# EAGLE design moister-proto (EAGLE 7.7.0)

## Sheet 1 of 4
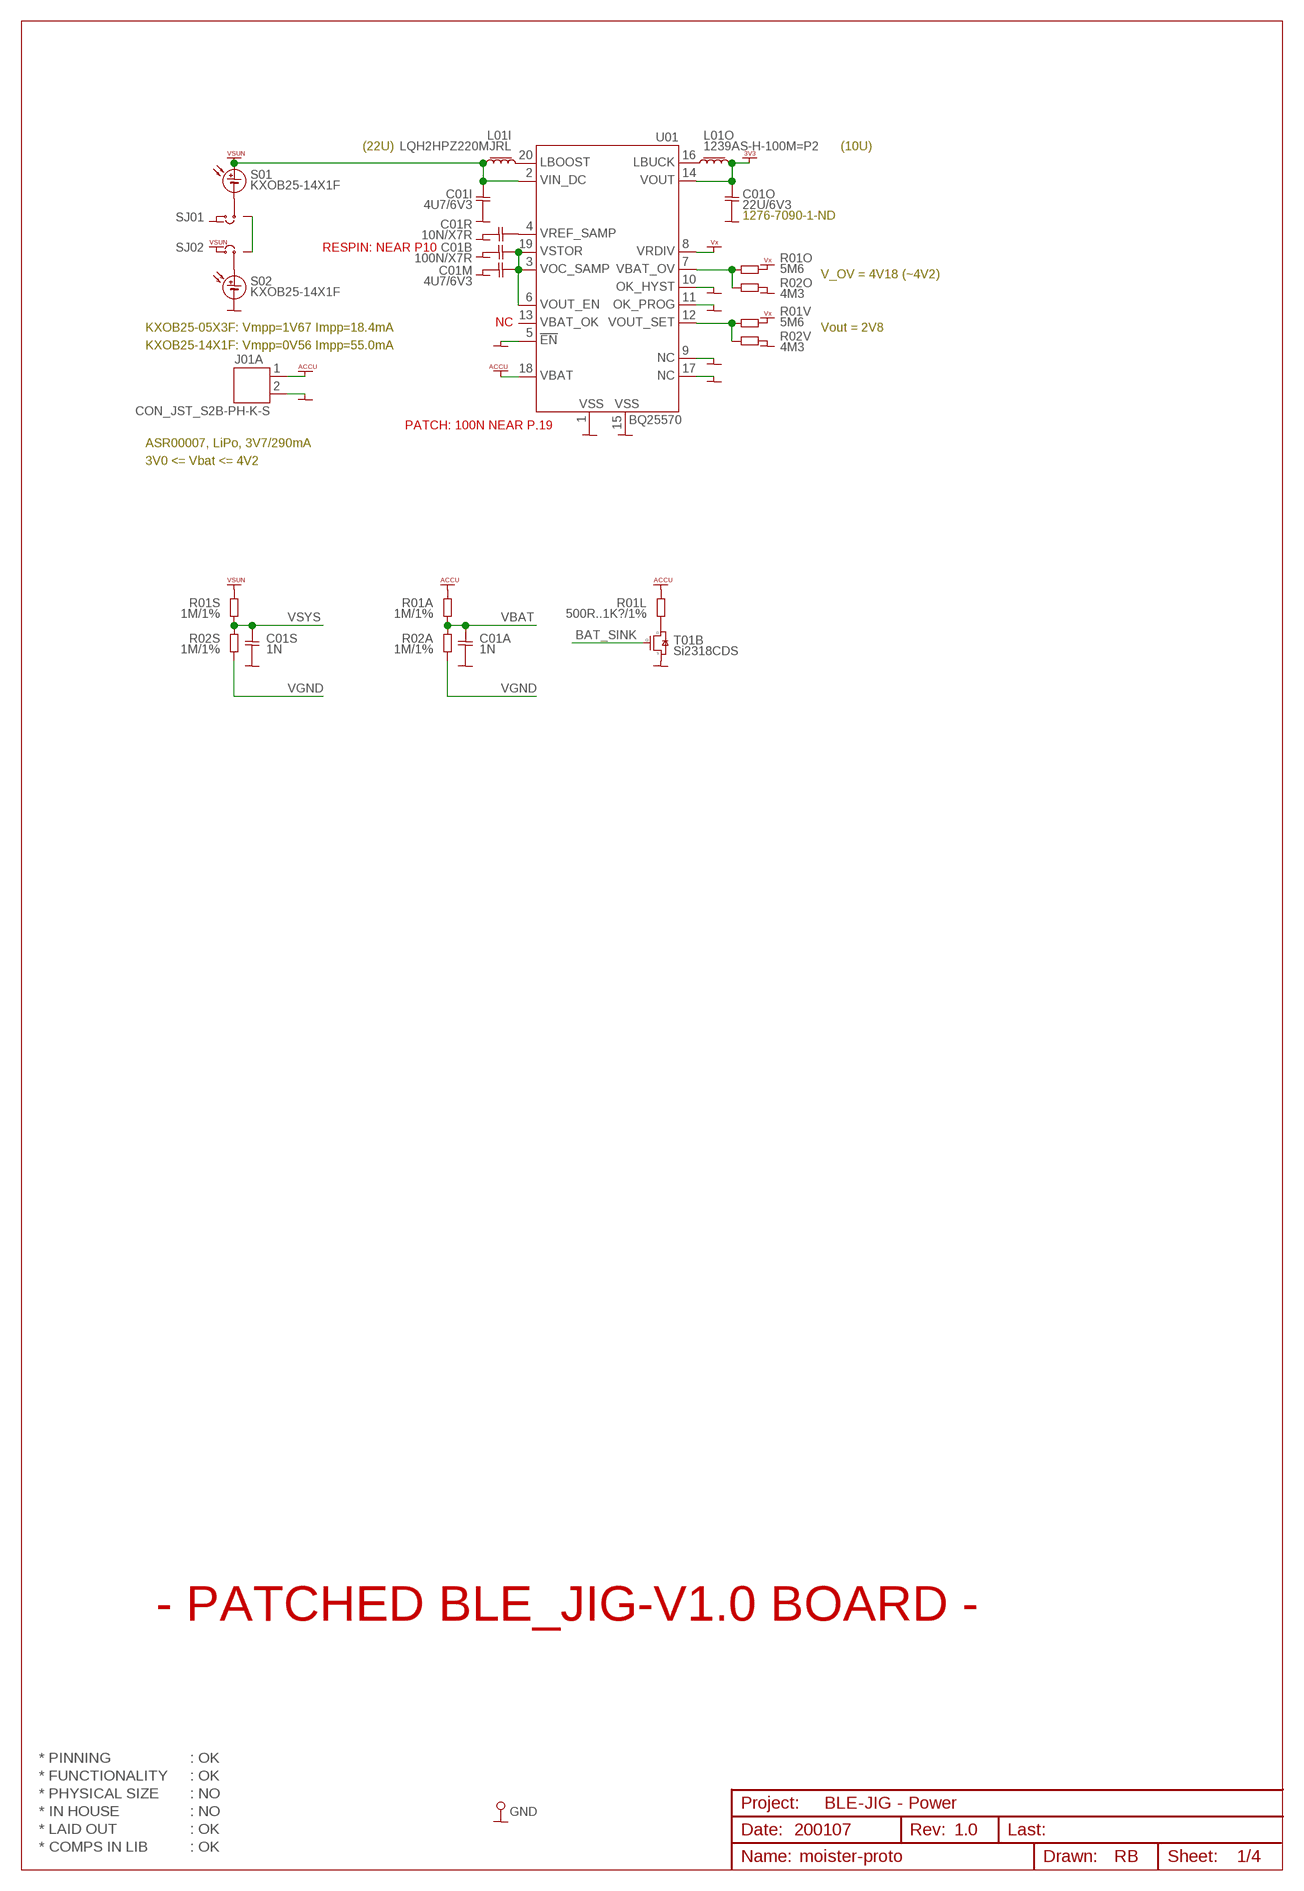
[diagram p0: schematic, sheet 1]

### Parts
C01A  1N  CAP0402  [CAP0402]
C01B  100N/X7R  CAP0402  [CAP0402]
C01I  4U7/6V3  CAP0402  [CAP0402]
C01M  4U7/6V3  CAP0402  [CAP0402]
C01O  22U/6V3  CAP0402  [CAP0402]
C01R  10N/X7R  CAP0402  [CAP0402]
C01S  1N  CAP0402  [CAP0402]
GND  PIN_TEST  [HOLE_PTH_0.8MM]
J01A  CON_JST_S2B-PH-K-S  [CON_JST_S2B-PH-K-S]
L01I  LQH2HPZ220MJRL  L_1008  [L_1008]
L01O  1239AS-H-100M=P2  L_1008  [L_1008]
R01A  1M/1%  RES0402  [RES0402]
R01L  500R..1K?/1%  RES0603  [RES0603]
R01O  5M6  RES0402  [RES0402]
R01S  1M/1%  RES0402  [RES0402]
R01V  5M6  RES0402  [RES0402]
R02A  1M/1%  RES0402  [RES0402]
R02O  4M3  RES0402  [RES0402]
R02S  1M/1%  RES0402  [RES0402]
R02V  4M3  RES0402  [RES0402]
S01  KXOB25-14X1F  [KXOB25-14X1F]
S02  KXOB25-14X1F  [KXOB25-14X1F]
SJ01  SJ3SJ3-S  [SJ3-S]
SJ02  SJ3SJ3-S  [SJ3-S]
T01B  Si2318CDS  NFET_SOT23  [NFET_SOT23]
U01  BQ25570  [VQFN20]

### Nets
ACCU: J01A.1 R01A.2 R01L.2 U01.18(18.VBAT) ; supply symbol labelled VACCU
BAT_SINK: T01B.1(G1) ; also sheet 2
GND: C01A.2 C01B.2 C01I.2 C01M.2 C01O.2 C01R.2 C01S.2 GND.1 J01A.2 R02O.2 R02V.2 S02.2 SJ01.1 T01B.2(S2) U01.1(1.VSS) U01.5(5.!EN) U01.9(9.NC) U01.10(10.OK_HYST) U01.11(11.OK_PROG) U01.15(15.VSS) U01.17(17.NC) U01.TP(15.VSS) U01.V1(15.VSS) U01.V2(15.VSS) U01.V3(15.VSS) U01.V4(15.VSS) ; also sheet 2,3,4
N$1: S01.2 SJ01.2
N$4: S02.1 SJ02.2
N$6: SJ01.3 SJ02.3
N$8: R01L.1 T01B.3(D3)
N$11: C01R.1 U01.4(4.VREF_SAMP)
N$16: L01I.2 U01.20(20.LBOOST)
N$17: L01O.1 U01.16(16.LBUCK)
VBAT: C01A.1 R01A.1 R02A.2 ; also sheet 2
VBAT_OV: R01O.2 R02O.1 U01.7(7.VBAT_OV)
VDD_3V3: C01O.1 L01O.2 U01.14(14.VOUT) ; supply symbol labelled VCC_3V3 ; also sheet 2,3,4
VGND: R02A.1 R02S.1 ; also sheet 2
VOUT_SET: R01V.2 R02V.1 U01.12(12.VOUT_SET)
VSTOR: C01B.1 C01M.1 U01.3(3.VOC_SAMP) U01.6(6.VOUT_EN) U01.19(19.VSTOR)
VSUN: C01I.1 L01I.1 R01S.2 S01.1 SJ02.1 U01.2(2.VIN_DC)
VSYS: C01S.1 R01S.1 R02S.2 ; also sheet 2
VX: R01O.1 R01V.1 U01.8(8.VRDIV)
Unconnected: U01.13(13.VBAT_OK)

### Notes on the sheet
- (22U) | (10U)
- 1276-7090-1-ND
- RESPIN: NEAR P10
- V_OV = 4V18 (~4V2)
- NC
- KXOB25-05X3F: Vmpp=1V67 Impp=18.4mA | Vout = 2V8
- KXOB25-14X1F: Vmpp=0V56 Impp=55.0mA
- PATCH: 100N NEAR P.19
- ASR00007, LiPo, 3V7/290mA
- 3V0 <= Vbat <= 4V2
- - PATCHED BLE_JIG-V1.0 BOARD -
- * PINNING | : OK
- * FUNCTIONALITY | : OK
- * PHYSICAL SIZE | : NO
- BLE-JIG - Power
- * IN HOUSE | : NO
- * LAID OUT | : OK | 200107 | 1.0
- * COMPS IN LIB | : OK

## Sheet 2 of 4
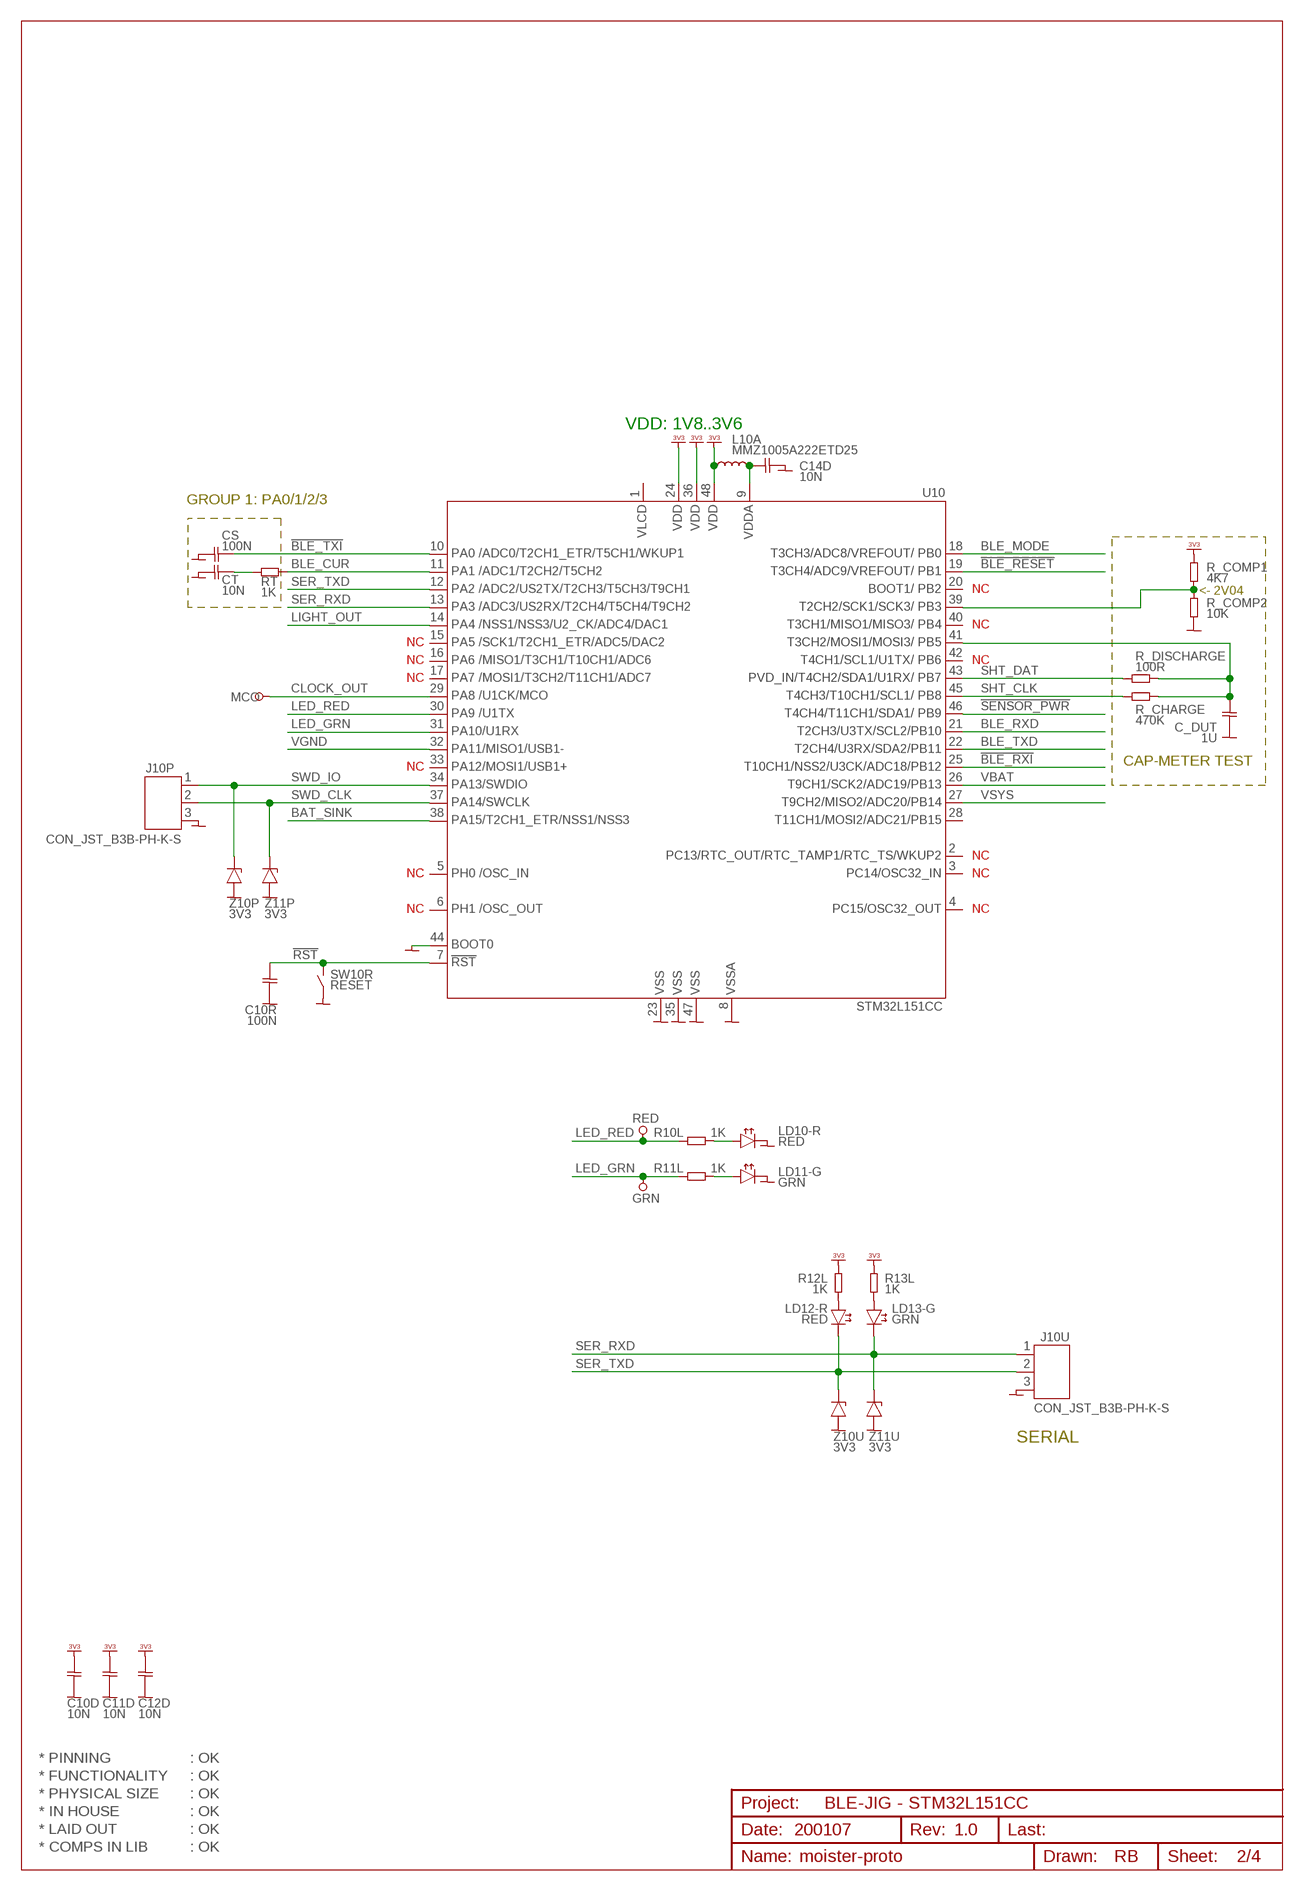
[diagram p1: schematic, sheet 2]

### Parts
C10D  10N  CAP0402  [CAP0402]
C10R  100N  CAP0402  [CAP0402]
C11D  10N  CAP0402  [CAP0402]
C12D  10N  CAP0402  [CAP0402]
C14D  10N  CAP0402  [CAP0402]
C_DUT  1U  CAP0603  [CAP0603]
CS  100N  CAP0805  [CAP0805]
CT  10N  CAP0805  [CAP0805]
GRN  PIN_TEST_0.6MM  [HOLE_PTH_0.6MM]
J10P  CON_JST_B3B-PH-K-S  [CON_JST_B3B-PH-K-S]
J10U  CON_JST_B3B-PH-K-S  [CON_JST_B3B-PH-K-S]
L10A  MMZ1005A222ETD25  L_0402  [L_0402]
LD10-R  RED  LED_SMD_0603  [LED_SMD_0603]
LD11-G  GRN  LED_SMD_0603  [LED_SMD_0603]
LD12-R  RED  LED_SMD_0603  [LED_SMD_0603]
LD13-G  GRN  LED_SMD_0603  [LED_SMD_0603]
MCO  PIN_TEST  [HOLE_PTH_0.8MM]
R10L  1K  RES0402  [RES0402]
R11L  1K  RES0402  [RES0402]
R12L  1K  RES0402  [RES0402]
R13L  1K  RES0402  [RES0402]
R_CHARGE  470K  RES0603  [RES0603]
R_COMP1  4K7  RES0603  [RES0603]
R_COMP2  10K  RES0603  [RES0603]
R_DISCHARGE  100R  RES0603  [RES0603]
RED  PIN_TEST_0.6MM  [HOLE_PTH_0.6MM]
RT  1K  RES0805  [RES0805]
SW10R  RESET  SWITCH_PUSHBUTTON_EVP-AVAA1A  [SWITCH_PUSHBUTTON_EVP-AVAA1A]
U10  STM32L151CC  [LQFP48]
Z10P  3V3  ZENER_SOD80  [ZENER_SOD80]
Z10U  3V3  ZENER_SOD80  [ZENER_SOD80]
Z11P  3V3  ZENER_SOD80  [ZENER_SOD80]
Z11U  3V3  ZENER_SOD80  [ZENER_SOD80]

### Nets
!BLE_RESET: U10.19(19.PB1) ; also sheet 3
!BLE_RXI: U10.25(25.PB12) ; also sheet 3
!BLE_TXI: CS.2 U10.10(10.PA0) ; also sheet 3
!RST: C10R.1 SW10R.1(1-2) U10.7(7.!RST)
!SENSOR_PWR: U10.46(46.PB9) ; also sheet 4
BAT_SINK: U10.38(38.PA15) ; also sheet 1
BLE_CUR: RT.1 U10.11(11.PA1) ; also sheet 3
BLE_MODE: U10.18(18.PB0) ; also sheet 3
BLE_RXD: U10.21(21.PB10) ; also sheet 3
BLE_TXD: U10.22(22.PB11) ; also sheet 3
CLOCK_OUT: MCO.1 U10.29(29.PA8)
COMP+: C_DUT.1 R_CHARGE.2 R_DISCHARGE.2 U10.41(41.PB5)
COMP-: R_COMP1.2 R_COMP2.1 U10.39(39.PB3)
GND: C10D.2 C10R.2 C11D.2 C12D.2 C14D.2 C_DUT.2 CS.1 CT.1 J10P.3 J10U.3 LD10-R.C LD11-G.C R_COMP2.2 SW10R.2(3-4) U10.8(8.GND) U10.23(23.GND) U10.35(35.GND) U10.44(44.BOOT0) U10.47(47.GND) Z10P.1(A) Z10U.1(A) Z11P.1(A) Z11U.1(A) ; also sheet 1,3,4
LED_GRN: GRN.1 R11L.1 U10.31(31.PA10)
LED_RED: R10L.1 RED.1 U10.30(30.PA9)
LIGHT_OUT: U10.14(14.PA4) ; also sheet 4
N$2: CT.2 RT.2
N$5: LD13-G.A R13L.2
N$7: LD12-R.A R12L.2
N$38: LD11-G.A R11L.2
N$39: LD10-R.A R10L.2
SER_RXD: J10U.1 LD13-G.C U10.13(13.PA3) Z11U.2(C)
SER_TXD: J10U.2 LD12-R.C U10.12(12.PA2) Z10U.2(C)
SHT_CLK: R_CHARGE.1 U10.45(45.PB8) ; also sheet 4
SHT_DAT: R_DISCHARGE.1 U10.43(43.PB7) ; also sheet 4
SWD_CLK: J10P.2 U10.37(37.PA14) Z11P.2(C)
SWD_IO: J10P.1 U10.34(34.PA13) Z10P.2(C)
VBAT: U10.26(26.PB13) ; also sheet 1
VDD_3V3: C10D.1 C11D.1 C12D.1 L10A.1 R12L.1 R13L.1 R_COMP1.1 U10.24(24.VDD) U10.36(36.VDD) U10.48(48.VDD) ; supply symbol labelled VCC_3V3 ; also sheet 1,3,4
VDDA: C14D.1 L10A.2 U10.9(9.VDD)
VGND: U10.32(32.PA11) ; also sheet 1
VSYS: U10.27(27.PB14) ; also sheet 1
Unconnected: U10.1(1.VDD) U10.2(2.PC13) U10.3(3.PC14) U10.4(4.PC15) U10.5(5.OSC_IN) U10.6(6.OSC_OUT) U10.15(15.PA5) U10.16(16.PA6) U10.17(17.PA7) U10.20(20.PB2) U10.28(28.PB15) U10.33(33.PA12) U10.40(40.PB4) U10.42(42.PB6)

### Notes on the sheet
- VDD: 1V8..3V6
- GROUP 1: PA0/1/2/3
- NC | <- 2V04
- NC
- NC
- NC | NC
- NC
- CAP-METER TEST
- NC
- NC
- NC | NC
- NC | NC
- SERIAL
- * PINNING | : OK
- * FUNCTIONALITY | : OK
- * PHYSICAL SIZE | : OK
- BLE-JIG - STM32L151CC
- * IN HOUSE | : OK
- * LAID OUT | : OK | 200107 | 1.0
- * COMPS IN LIB | : OK

## Sheet 3 of 4
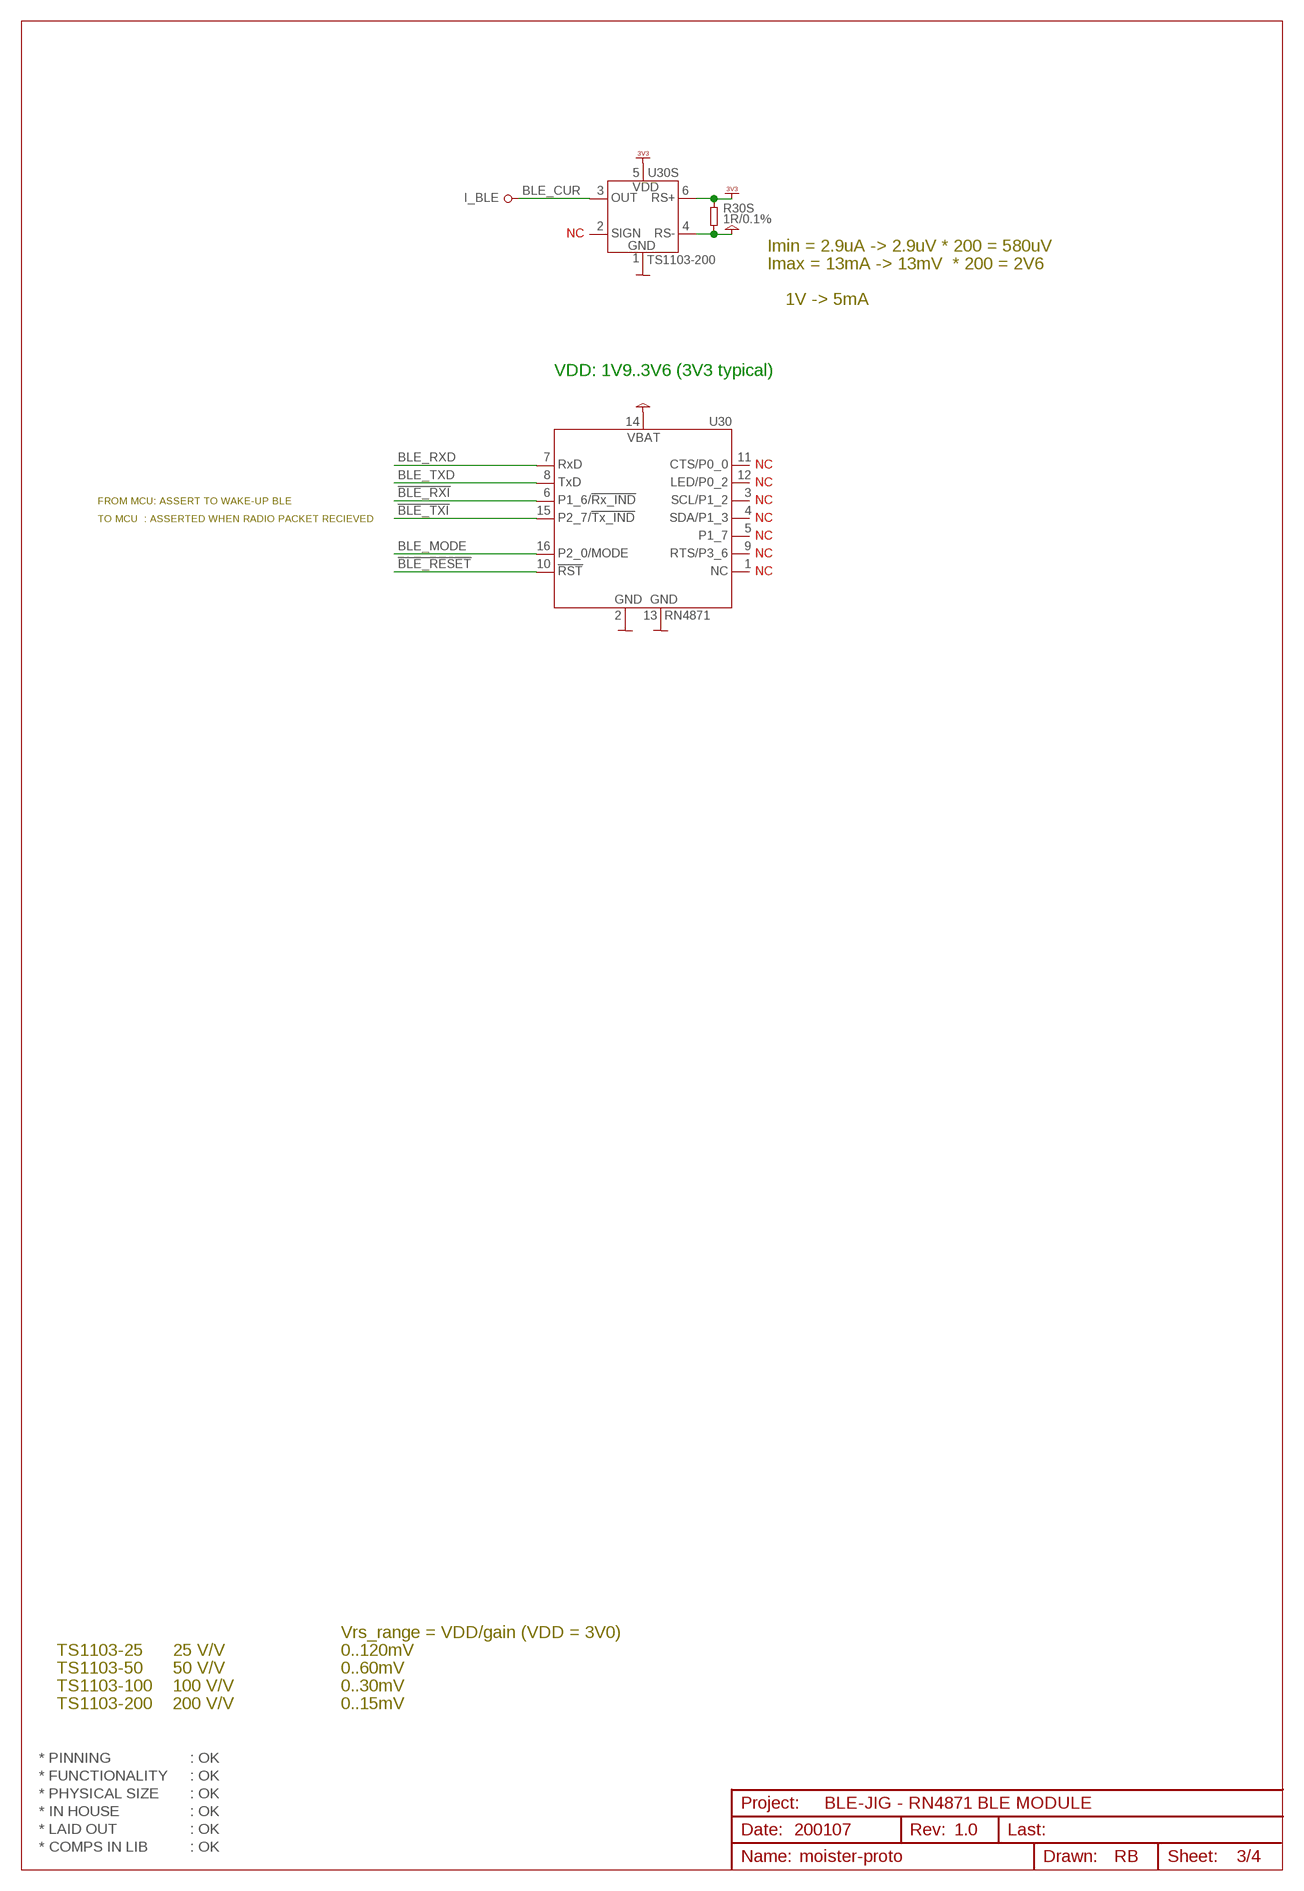
[diagram p2: schematic, sheet 3]

### Parts
I_BLE  PIN_TEST  [HOLE_PTH_0.8MM]
R30S  1R/0.1%  RES0603  [RES0603]
U30  RN4871  [RN4871]
U30S  TS1103-200  [SOT23-6]

### Nets
!BLE_RESET: U30.10(10.!RST) ; also sheet 2
!BLE_RXI: U30.6(6.P1_6) ; also sheet 2
!BLE_TXI: U30.15(15.P2_7) ; also sheet 2
BLE_CUR: I_BLE.1 U30S.3(3.OUT) ; also sheet 2
BLE_MODE: U30.16(16.P2_0) ; also sheet 2
BLE_RXD: U30.7(7.RXD) ; also sheet 2
BLE_TXD: U30.8(8.TXD) ; also sheet 2
GND: U30.2(2.GND) U30.13(13.GND) U30S.1(1.GND) ; also sheet 1,2,4
VCC: R30S.2 U30.14(14.VBAT) U30S.4(4.RS-)
VDD_3V3: R30S.1 U30S.5(5.VDD) U30S.6(6.RS+) ; supply symbol labelled VCC_3V3 ; also sheet 1,2,4
Unconnected: U30.1(1.NC) U30.3(3.P1_2) U30.4(4.P1_3) U30.5(5.P1_7) U30.9(9.P3_6) U30.11(11.P0_0) U30.12(12.P0_2) U30S.2(2.SIGN)

### Notes on the sheet
- NC
- Imin = 2.9uA -> 2.9uV * 200 = 580uV
- Imax = 13mA -> 13mV  * 200 = 2V6
- 1V -> 5mA
- VDD: 1V9..3V6 (3V3 typical)
- NC
- NC
- FROM MCU: ASSERT TO WAKE-UP BLE | NC
- TO MCU  : ASSERTED WHEN RADIO PACKET RECIEVED | NC
- NC
- NC
- NC
- Vrs_range = VDD/gain (VDD = 3V0)
- TS1103-25      25 V/V | 0..120mV
- TS1103-50      50 V/V | 0..60mV
- TS1103-100    100 V/V | 0..30mV
- TS1103-200    200 V/V | 0..15mV
- * PINNING | : OK
- * FUNCTIONALITY | : OK
- * PHYSICAL SIZE | : OK
- BLE-JIG - RN4871 BLE MODULE
- * IN HOUSE | : OK
- * LAID OUT | : OK | 200107 | 1.0
- * COMPS IN LIB | : OK

## Sheet 4 of 4
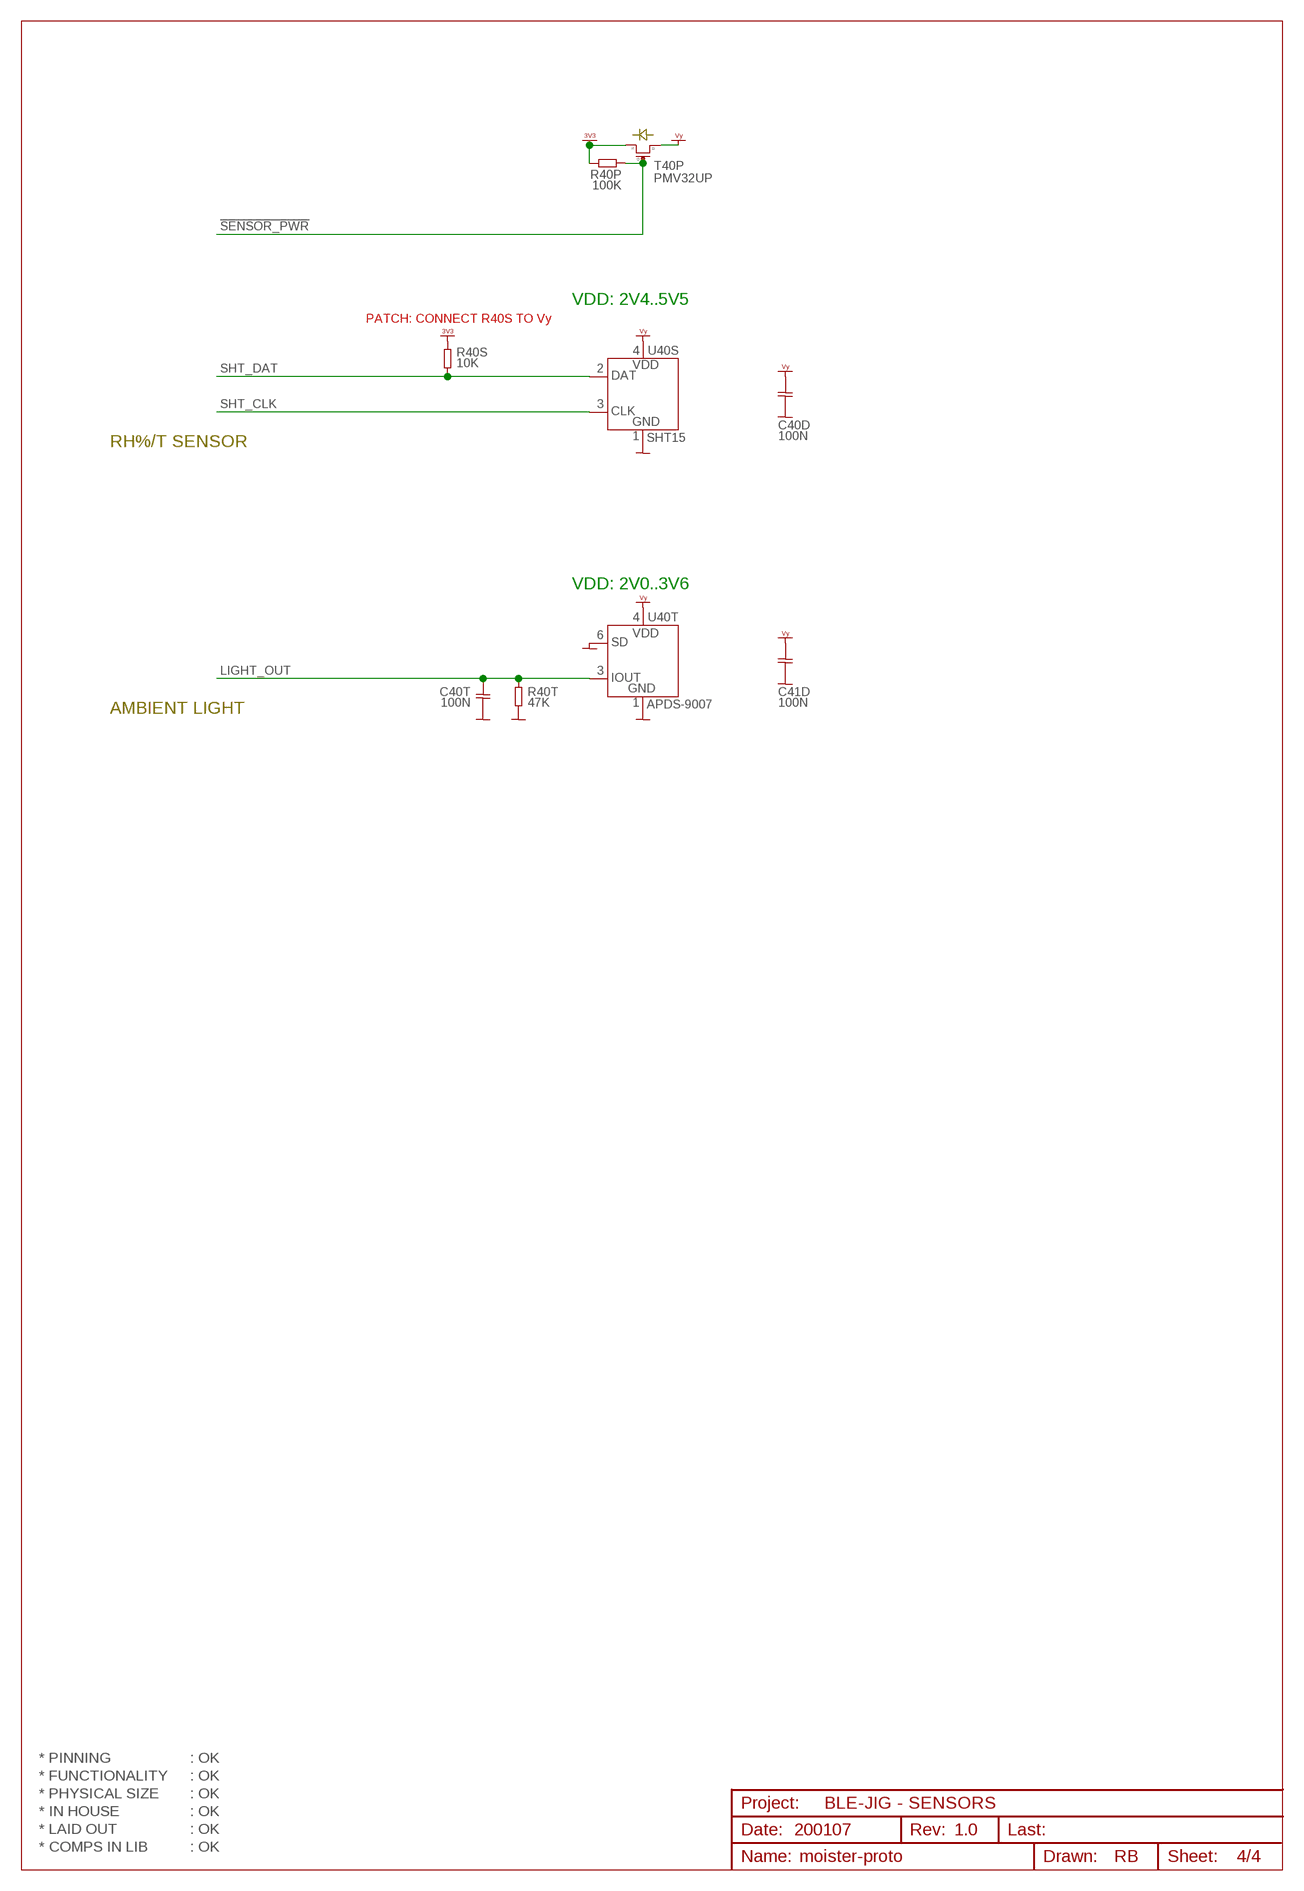
[diagram p3: schematic, sheet 4]

### Parts
C40D  100N  CAP0402  [CAP0402]
C40T  100N  CAP0402  [CAP0402]
C41D  100N  CAP0402  [CAP0402]
R40P  100K  RES0402  [RES0402]
R40S  10K  RES0402  [RES0402]
R40T  47K  RES0402  [RES0402]
T40P  PMV32UP  PFET_SOT23  [PFET_SOT23]
U40S  SHT15  [SHT15]
U40T  APDS-9007  [APDS-9007]

### Nets
!SENSOR_PWR: R40P.2 T40P.1(G) ; also sheet 2
GND: C40D.2 C40T.2 C41D.2 R40T.2 U40S.1(1.GND) U40T.1(1.GND) U40T.6(6.SD) ; also sheet 1,2,3
LIGHT_OUT: C40T.1 R40T.1 U40T.3(3.IOUT) ; also sheet 2
SHT_CLK: U40S.3(3.CLK) ; also sheet 2
SHT_DAT: R40S.2 U40S.2(2.DAT) ; also sheet 2
VDD_3V3: R40P.1 R40S.1 T40P.2(S) ; supply symbol labelled VCC_3V3 ; also sheet 1,2,3
VY: C40D.1 C41D.1 T40P.3(D) U40S.4(4.VDD) U40T.4(4.VDD)

### Notes on the sheet
- VDD: 2V4..5V5
- PATCH: CONNECT R40S TO Vy
- RH%/T SENSOR
- VDD: 2V0..3V6
- AMBIENT LIGHT
- * PINNING | : OK
- * FUNCTIONALITY | : OK
- * PHYSICAL SIZE | : OK
- BLE-JIG - SENSORS
- * IN HOUSE | : OK
- * LAID OUT | : OK | 200107 | 1.0
- * COMPS IN LIB | : OK

## Library data of the parts
C01A C01B C01I C01M C01O C01R C01S C10D C10R C11D C12D C14D C40D C40T C41D = 00-own_parts:CAP0402: Capacitor, ceramic, 0402
C_DUT = 00-own_parts:CAP0603: Capacitor, ceramic, 0603
CS CT = 00-own_parts:CAP0805: Capacitor, ceramic, 0805
GND I_BLE MCO = 00-own_parts:PIN_TEST: Pin, test pad, hole 0.8mm, pad 1.6mm
GRN RED = 00-own_parts:PIN_TEST_0.6MM: Pin, test pad, hole 0.6mm, pad 1.0mm
J01A = 00-own_parts:CON_JST_S2B-PH-K-S: Connector, JST, 2.0mm pitch, 2p, side entry
J10P J10U = 00-own_parts:CON_JST_B3B-PH-K-S: Connector, JST, 2.0mm pitch, 3p, top entry
L01I L01O = 00-own_parts:L_1008: Inductor, 1008 (2520 metric), chip ferrite bead/wirewound
L10A = 00-own_parts:L_0402: Inductor, 0402
LD10-R LD11-G LD12-R LD13-G = 00-own_parts:LED_SMD_0603: LED, SMD, 0603
R01A R01L R01O R01S R01V R02A R02O R02S R02V R10L R11L R12L R13L R30S R40P R40S R40T R_CHARGE R_COMP1 R_COMP2 R_DISCHARGE RT = 00-own_parts:RES
S01 S02 = 00-own_parts:KXOB25-14X1F: Solar cell, monocrystalline, high efficiency, Voc = 0V69, Isc = 58.6mA, Vmpp = 0V56, Impp = 55.0mA, Vmmp @ 81% Voc
SJ01 SJ02 = 00-own_parts:SJ3: Solder jumper, SMD, 3 way
SW10R = 00-own_parts:SWITCH_PUSHBUTTON_EVP-AVAA1A: Switch, push button, EVP-AVAA1A, SPNO, miniature, PCB edge, 2.8x2.3mm, DK# P16849CT-ND
T01B = 00-own_parts:NFET_SOT23: n-FET, generic SOT23
T40P = 00-own_parts:PFET_SOT23: p-FET, generic, SOT23
U01 = 00-own_parts:BQ25570: DC/DC, nano power boost battery charger with MPPT and buck converter DC/DC, VQFN20
U10 = 00-own_parts:STM32L151CC: MCU, ultra-low power, ARM Cortex M3, 32-bit, 32 MHz, 256 kB Flash, 32 kB SRAM, 8 kB EEPROM, USB, ADC, DAC, LQFP48
U30 = 00-own_parts:RN4871: Wireless module, Bluetooth Low Energy, integrated antenna
U30S = 00-own_parts:TS1103-200: Current sense amplifier, bi-directional, 200x gain, SOT23-6, F#243-7987
U40S = 00-own_parts:SHT15: Sensor, humidity & temperature, F# 159-0512
U40T = 00-own_parts:APDS-9007: Sensor, logaritmic 3..70K lux ambient light, light-to-current converter, F#154-8112
Z10P Z10U Z11P Z11U = 00-own_parts:ZENER_SOD80: Zener, generic SOD80

## Board
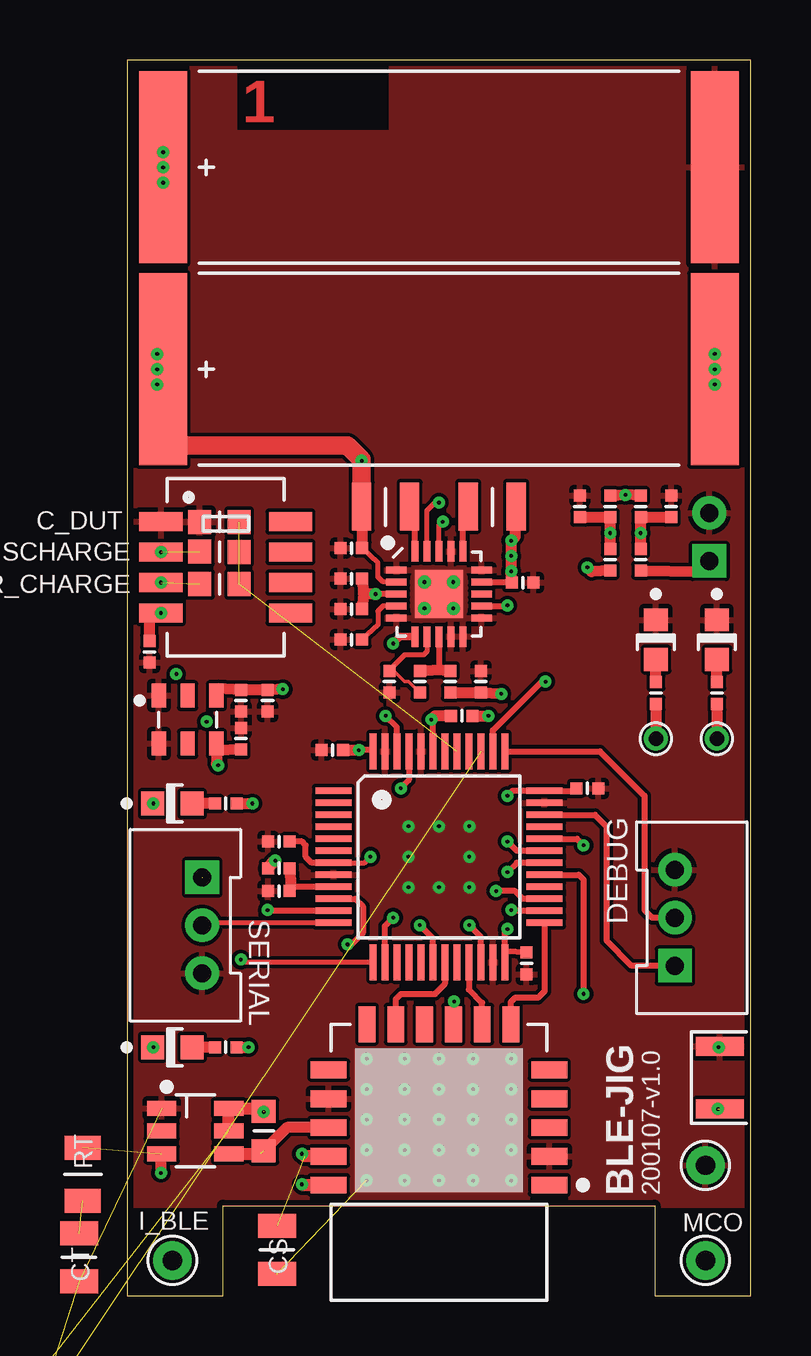
[diagram p4: board, top side]
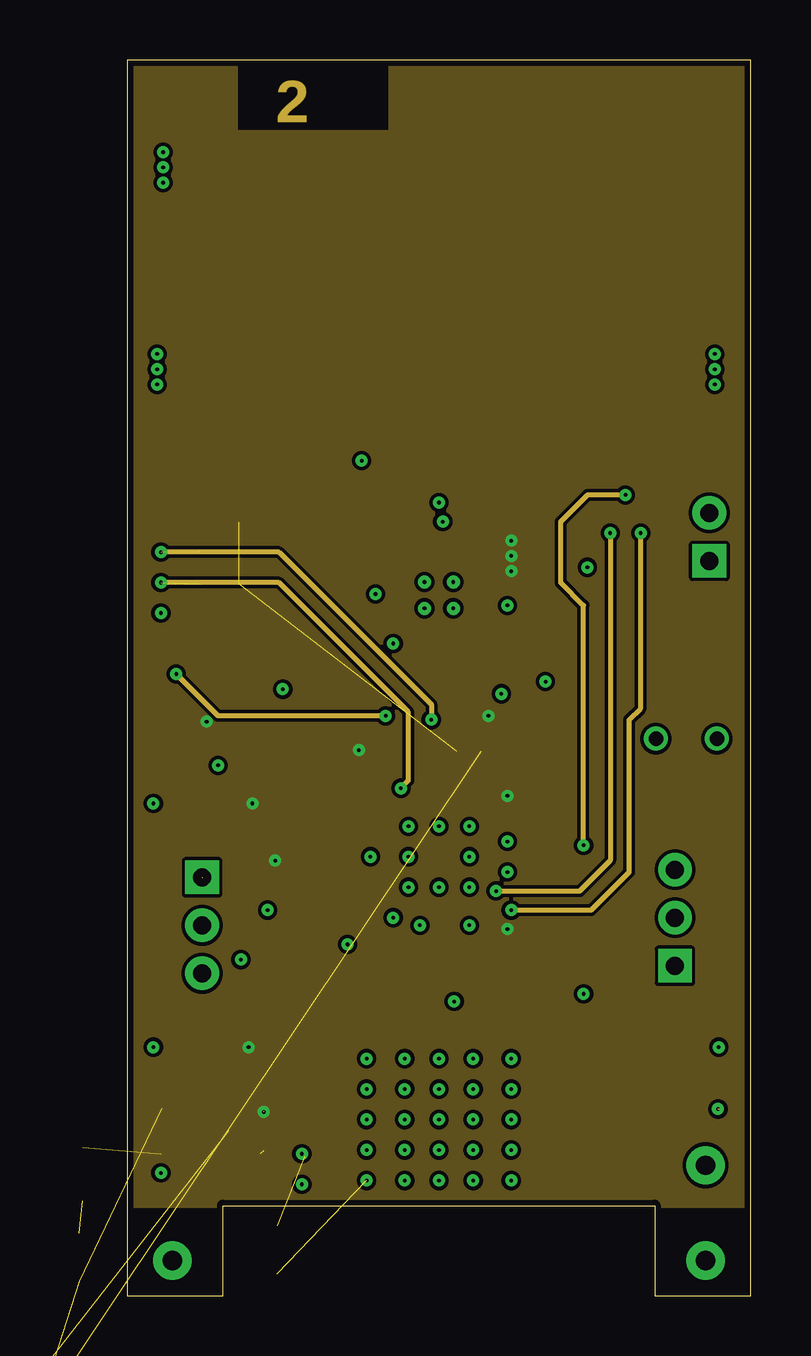
[diagram p5: board, inner layer Route2]
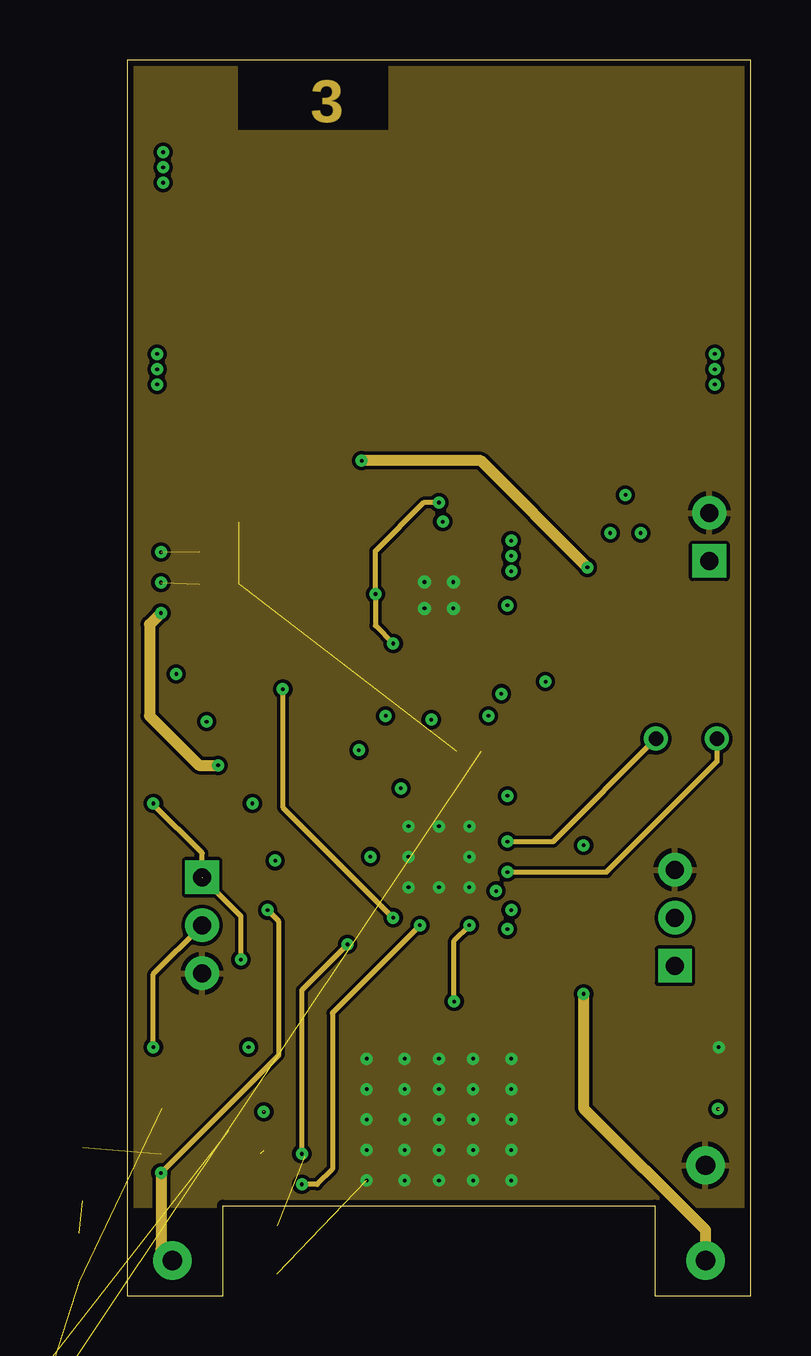
[diagram p6: board, inner layer Route15]
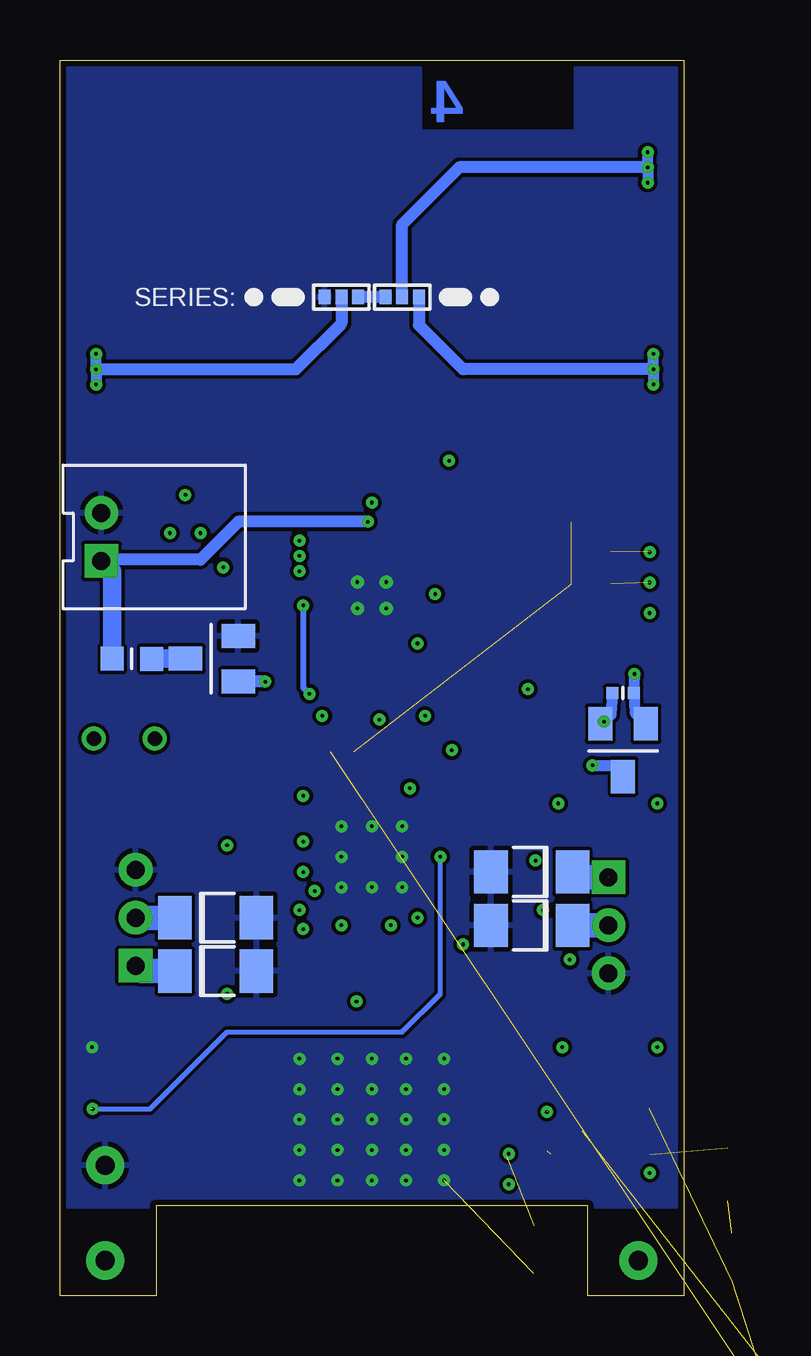
[diagram p7: board, bottom side, seen from below]

Size 26 x 51.5 mm. Coordinates in mm from the lower left corner, seen from the top.
Outline: 26,0 26,51.5 0,51.5 0,0 4,0 4,3.75 22,3.75 22,0 26,0
Copper layers (1*2*15*16): Top 0.018mm / dielectric 0.36mm / Route2 0.035mm / dielectric 0.71mm / Route15 0.035mm / dielectric 0.36mm / Bottom 0.018mm
Design rules "default": minimum track width 0.15mm, minimum drill 0.15mm, track to track 0.15mm, track to pad 0.15mm, pad to pad 0.15mm, via to via 0.15mm, smd to smd 0mil, copper to edge 0.25mm, drill to drill 0.3mm, minimum pad ring 0.2mm, minimum via ring 0.125mm, stop-mask expansion 0.1mm, vias tented up to drill 0.15mm, thermal gap 0.2mm

### Footprints (pad centres in the part's own frame; a part is rotated, then mirrored left to right if it is on the bottom)
CAP0402 = smd 0.5 x 0.5: 1 -0.45,0; 2 0.45,0
CAP0603 = smd 0.95 x 1: 1 -0.821,0.002; 2 0.822,0
CAP0805 = smd 1 x 1.6: 1 -1,0; 2 1,0
HOLE_PTH_0.8MM = drill 0.8 pad 1.6: 1 0,0
HOLE_PTH_0.6MM = drill 0.6 pad 1: 1 0,0
CON_JST_S2B-PH-K-S = drill 0.75 pad 1.4 square: 1 -1,0 | drill 0.75 pad 1.4: 2 1,0
CON_JST_B3B-PH-K-S = drill 0.75 pad 1.4 square: 1 -2,0 | drill 0.75 pad 1.4: 2 0,0; 3 2,0
L_1008 = smd 0.8 x 2: 1 -1,0; 2 1,0
L_0402 = smd 0.5 x 0.5: 1 -0.45,0; 2 0.45,0
LED_SMD_0603 = smd 0.95 x 1: A -0.827,0; C 0.827,0
RES0402 = smd 0.5 x 0.5: 1 -0.45,0; 2 0.45,0
RES0603 = smd 0.95 x 1: 1 -0.821,0.002; 2 0.822,0
RES0805 = smd 1 x 1.5: 1 -1.1,0; 2 1.1,0
KXOB25-14X1F = smd 2 x 8: 1 -11.5,0; 2 11.5,0
SJ3-S = smd 0.5 x 0.6: 1 -0.7,0; 2 0.004,0; 3 0.7,0
SWITCH_PUSHBUTTON_EVP-AVAA1A = smd 0.8 x 2: 1 -1.3,1.3; 2 1.3,1.3
NFET_SOT23 = smd 1 x 1.4: 1 -0.95,-1.1; 2 0.95,-1.1; 3 0,1.1
PFET_SOT23 = smd 1 x 1.4: 1 -0.95,-1.1; 2 0.95,-1.1; 3 0,1.1
VQFN20 = smd 0.28 x 0.85: 1 -1,-1.775; 2 -0.5,-1.775; 3 0,-1.775; 4 0.5,-1.775; 5 1,-1.775; 11 1,1.775; 12 0.5,1.775; 13 0,1.775; 14 -0.5,1.775; 15 -1,1.775 | smd 0.85 x 0.28: 6 1.775,-1; 7 1.775,-0.5; 8 1.775,0; 9 1.775,0.5; 10 1.775,1; 16 -1.775,1; 17 -1.775,0.5; 18 -1.775,0; 19 -1.775,-0.5; 20 -1.775,-1 | smd 2 x 2: TP 0,0 | drill 0.15 pad 0.5: V1 -0.5,0.6; V2 0.6,0.6; V3 -0.5,-0.6; V4 0.6,-0.6
LQFP48 = smd 0.28 x 1.5: 1 -2.75,-4.4; 2 -2.25,-4.4; 3 -1.75,-4.4; 4 -1.25,-4.4; 5 -0.75,-4.4; 6 -0.25,-4.4; 7 0.25,-4.4; 8 0.75,-4.4; 9 1.25,-4.4; 10 1.75,-4.4; 11 2.25,-4.4; 12 2.75,-4.4; 25 2.75,4.4; 26 2.25,4.4; 27 1.75,4.4; 28 1.25,4.4; 29 0.75,4.4; 30 0.25,4.4; 31 -0.25,4.4; 32 -0.75,4.4; 33 -1.25,4.4; 34 -1.75,4.4; 35 -2.25,4.4; 36 -2.75,4.4 | smd 1.5 x 0.28: 13 4.4,-2.75; 14 4.4,-2.25; 15 4.4,-1.75; 16 4.4,-1.25; 17 4.4,-0.75; 18 4.4,-0.25; 19 4.4,0.25; 20 4.4,0.75; 21 4.4,1.25; 22 4.4,1.75; 23 4.4,2.25; 24 4.4,2.75; 37 -4.4,2.75; 38 -4.4,2.25; 39 -4.4,1.75; 40 -4.4,1.25; 41 -4.4,0.75; 42 -4.4,0.25; 43 -4.4,-0.25; 44 -4.4,-0.75; 45 -4.4,-1.25; 46 -4.4,-1.75; 47 -4.4,-2.25; 48 -4.4,-2.75
RN4871 = smd 1.5 x 0.7: 1 -4.6,6.7; 2 -4.6,5.5; 3 -4.6,4.3; 4 -4.6,3.1; 5 -4.6,1.9; 12 4.6,1.9; 13 4.6,3.1; 14 4.6,4.3; 15 4.6,5.5; 16 4.6,6.7 | smd 0.7 x 1.5: 6 -3,0; 7 -1.8,0; 8 -0.6,0; 9 0.6,0; 10 1.8,0; 11 3,0
SOT23-6 = smd 0.62 x 1.22: 1 -0.95,-1.4; 2 0,-1.4; 3 0.95,-1.4; 4 0.95,1.4; 5 0,1.4; 6 -0.95,1.4
SHT15 = smd 1.8 x 0.8: 1 -2.7,1.905; 2 -2.7,0.635; 3 -2.7,-0.635; 4 -2.7,-1.905; 5 2.7,-1.905; 6 2.7,-0.635; 7 2.7,0.635; 8 2.7,1.905
APDS-9007 = smd 0.6 x 1: 1 -1.2,1; 2 0,1; 3 1.2,1; 4 1.2,-1; 5 0,-1; 6 -1.2,-1
ZENER_SOD80 = smd 1.4 x 1.8: 1 -1.7,0; 2 1.7,0

### Placement (x,y rotation side)
C01A  22.68,32.89 90 top
C01B  9.35,28.61 180 top
C01I  9.35,31.15 180 top
C01M  9.35,29.88 180 top
C01O  16.49,29.72 0 top
C01R  9.35,27.34 180 top
C01S  18.87,32.89 90 top
C10D  16.65,13.84 270 top
C10R  6.33,18.92 180 top
C11D  19.19,21.14 0 top
C12D  8.55,22.73 180 top
C14D  6.33,16.86 180 top
C40D  0.94,26.83 270 top
C40T  4.74,24.8 270 top
C41D  4.74,23.21 90 top
C_DUT  3.85,32.25 180 top
CS  6.25,1.9 90 top
CT  -2,1.6 90 top
GND  24.11,5.43 0 top
GRN  22.05,23.21 270 top
I_BLE  1.89,1.46 180 top
J01A  24.27,31.62 90 bottom
J10P  22.84,15.75 90 top
J10U  3.13,15.43 270 top
L01I  10.78,32.89 0 top
L01O  15.22,32.89 0 top
L10A  6.33,17.81 0 top
LD10-R  24.59,27.34 90 top
LD11-G  22.05,27.34 90 top
LD12-R  1.89,10.35 180 top
LD13-G  1.89,20.51 180 top
MCO  24.11,1.46 90 top
R01A  21.41,30.67 270 top
R01L  23,26.54 180 bottom
R01O  12.21,25.59 270 top
R01S  20.14,30.67 270 top
R01V  13.48,25.59 270 top
R02A  21.41,32.89 270 top
R02O  10.94,25.59 270 top
R02S  20.14,32.89 270 top
R02V  14.75,25.59 90 top
R10L  24.59,25.11 90 top
R11L  22.05,25.11 90 top
R12L  4.11,10.35 180 top
R13L  4.11,20.51 180 top
R30S  5.7,6.86 270 top
R40P  2.52,25.11 0 bottom
R40S  13.95,24.16 180 top
R40T  5.86,24.8 270 top
R_CHARGE  3.85,29.65 0 top
R_COMP1  -6.8,-8.3 0 top  (outside the outline)
R_COMP2  -6.8,-11.75 0 top  (outside the outline)
R_DISCHARGE  3.85,31 0 top
RED  24.59,23.21 270 top
RT  -1.85,5.05 270 top
S01  13,38.61 0 top
S02  13,47.02 0 top
SJ01  14.27,41.62 0 bottom
SJ02  11.73,41.62 180 bottom
SW10R  26.02,9.08 90 top
T01B  19.67,26.54 90 bottom
T40P  2.52,22.73 180 bottom
U01  13,29.24 270 top
U10  13,18.29 270 top
U30  13,11.3 180 top
U30S  2.84,6.86 270 top
U40S  4.11,30.35 0 top
U40T  2.52,24 0 top
Z10P  19.51,13.53 180 bottom
Z10U  6.33,15.43 0 bottom
Z11P  19.51,15.75 180 bottom
Z11U  6.33,17.65 0 bottom

### Tracks (layer width: path | path; a pad name or v marks a point on that pad's centre or on a via)
!BLE_RESET
  Top 0.254: U30.10 11.2,12.36 11.41,12.57 12.84,12.57 13.25,12.98 U10.19
!BLE_RXI
  Top 0.254: U30.6 16,12.24 16.18,12.41 17.13,12.41 17.4,12.69 U10.25
!BLE_TXI  (via drill 0.15 pad 0.5)  (1 unrouted)
  Top 0.254: v9.19,14.64 9.35,14.64 9.82,15.11 9.82,16.22 9.51,16.54 U10.10
  Top 0.508: U30.15 7.39,5.8 v7.29,5.91
  Route15 0.203: v9.19,14.64 7.29,12.73 v7.29,5.91
!RST  (via drill 0.15 pad 0.5)  (1 unrouted)
  Top 0.203: U10.7 9.89,18.04 v10.14,18.29
  Top 0.254: U10.7 7.69,18.04 7.44,18.29 7.44,18.76 7.29,18.92 C10R.1
  Bottom 0.203: v10.14,18.29 10.14,12.57 11.73,10.98 19.03,10.98 22.25,7.77 v24.63,7.77
!SENSOR_PWR  (via drill 0.15 pad 0.5)
  Top 0.254: U10.46 11.25,23.69 v10.78,24.16
  Route2 0.203: v10.78,24.16 3.79,24.16 v2.05,25.91
  Bottom 0.457: T40P.1 2.02,24.28 R40P.2 2.02,25.88 v2.05,25.91
ACCU  (via drill 0.15 pad 0.5)
  Top 0.203: U01.18 13,32.1 v13.16,32.26
  Top 0.457: R01A.2 23.82,30.17 J01A.1
  Bottom 0.457: 24.22,30.67 J01A.1
  Bottom 0.508: v13.16,32.26 18.56,32.26 20.14,30.67 24.22,30.67
  Bottom 0.762: R01L.2 23.82,30.17 J01A.1
BAT_SINK  (via drill 0.15 pad 0.5)
  Top 0.254: U10.38 15.25,23.55 17.29,25.59 v17.45,25.59
  Bottom 0.254: T01B.1
  Bottom 0.508: v17.45,25.59 T01B.1
BLE_CUR  (via drill 0.15 pad 0.5)  (1 unrouted)
  Top 0.254: U10.11 5.88,16.04 v5.86,16.06
  Top 0.457: v1.41,5.11 1.41,5.88 U30S.3
  Route15 0.203: v1.41,5.11 6.33,10.03 6.33,15.59 v5.86,16.06
  Route15 0.457: v1.41,5.11 1.41,1.94 I_BLE.1
BLE_MODE  (via drill 0.15 pad 0.5)
  Top 0.254: U10.18 12.75,14.89 v12.21,15.43
  Top 0.508: U30.16 7.32,4.6 v7.29,4.63
  Route15 0.203: v7.29,4.63 7.92,4.63 8.55,5.27 8.55,11.78 v12.21,15.43
BLE_RXD
  Top 0.254: U10.21 14.25,12.75 14.8,12.2 U30.7
BLE_TXD  (via drill 0.15 pad 0.5)
  Top 0.254: 13.63,11.3 v13.63,12.26 | U10.22 14.75,14.95 v14.27,15.43
  Top 0.305: U30.8 13.63,11.3
  Route15 0.203: v13.63,12.26 13.63,14.79 v14.27,15.43
CLOCK_OUT  (via drill 0.15 pad 0.5)
  Top 0.254: U10.29 18.83,17.54 19.03,17.34 v19.03,12.57
  Route15 0.457: v19.03,12.57 19.03,7.81 24.11,2.73 MCO.1
COMP+  (3 unrouted)
COMP-  (2 unrouted)
GND  (via drill 0.15 pad 0.5)  (3 unrouted)
  other vias: 9.98,9.87 11.57,9.87 13,9.87 14.43,9.87 16.02,9.87 11.73,19.56 9.98,8.6 11.57,8.6 13,8.6 14.43,8.6 16.02,8.6 9.98,7.33 11.57,7.33 13,7.33 14.43,7.33 16.02,7.33 9.98,6.06 11.57,6.06 13,6.06 14.43,6.06 16.02,6.06 9.98,4.79 11.57,4.79 13,4.79 14.43,4.79 16.02,4.79 14.27,19.56 14.27,17.02 11.73,17.02 13,19.56 11.73,18.29 14.27,18.29 13,17.02 24.66,10.35
  pour Top (rank 6): 26,3.75 0,3.75 0.05,51.5 4.5,51.5 4.5,48.5 11,48.5 11,51.5 26,51.5
  pour Bottom (rank 6): 26,3.75 0,3.75 0,51.5 4.5,51.5 4.5,48.5 11,48.5 11,51.5 26,51.5
  pour Route15 (rank 2): 26,3.75 0,3.75 0,51.5 4.5,51.5 4.5,48.5 11,48.5 11,51.5 26,51.5
LED_GRN  (via drill 0.15 pad 0.5)
  Top 0.254: U10.31 16.24,18.54 v15.86,18.92
  Top 0.457: R11L.1 GRN.1
  Route15 0.203: v15.86,18.92 17.76,18.92 GRN.1
LED_RED  (via drill 0.15 pad 0.5)
  Top 0.254: U10.30 16.24,18.04 v15.86,17.65
  Top 0.457: R10L.1 RED.1
  Route15 0.203: v15.86,17.65 19.98,17.65 24.59,22.26 RED.1
LIGHT_OUT  (via drill 0.15 pad 0.5)
  Top 0.254: U10.14 10.75,15.4 v11.1,15.75
  Top 0.457: 3.75,25.25 3.72,25.27 | 3.75,25.25 3.8,25.3 C40T.1 R40T.1 6.47,25.3 v6.49,25.27 | U40T.3 3.74,25 3.79,24.95 3.79,25.2 3.75,25.25
  Route15 0.203: v6.49,25.27 6.49,20.35 v11.1,15.75
N$1  (via drill 0.15 pad 0.5)
  Bottom 0.457: v24.5,39.24 S01.2 v24.5,37.97
  Bottom 0.508: S01.2 16.18,38.61 14.27,40.52 SJ01.2
  other vias: 24.5,38.61
N$2  (1 unrouted)
N$4  (via drill 0.15 pad 0.5)
  Bottom 0.457: v1.5,47.66 S02.1 v1.5,46.39
  Bottom 0.508: SJ02.2 11.73,44.64 9.35,47.02 S02.1
  other vias: 1.5,47.02
N$5
  Top 0.457: R13L.2 LD13-G.A
N$6
  Bottom 0.508: SJ02.3 SJ01.3
N$7
  Top 0.457: R12L.2 LD12-R.A
N$8
  Bottom 0.762: T01B.3 R01L.1
N$11
  Top 0.203: U01.4 10.67,28.74 10.46,28.53 10.46,27.95 C01R.1
N$16
  Top 0.254: U01.20 12,32.67 L01I.2
N$17
  Top 0.254: U01.16 14,32.67 L01O.1
N$38
  Top 0.457: R11L.2 LD11-G.A
N$39
  Top 0.457: R10L.2 LD10-R.A
SER_RXD  (via drill 0.15 pad 0.5)  (1 unrouted)
  Top 0.203: U10.13 4.86,13.89 v4.74,14
  Top 0.762: 1.03,20.51 LD13-G.C v1.09,20.51
  Route15 0.203: v4.74,14 4.74,15.81 J10U.1 3.13,18.44 1.09,20.48 v1.09,20.51
  Bottom 1.016: J10U.1 4.41,17.43 Z11U.2
SER_TXD  (via drill 0.15 pad 0.5)
  Top 0.203: U10.12 3.23,15.54 J10U.2
  Top 0.762: 1.03,10.35 LD12-R.C v1.09,10.35
  Route15 0.203: v1.09,10.35 1.09,13.4 J10U.2
  Bottom 1.016: J10U.2 Z10U.2
SHT_CLK  (via drill 0.15 pad 0.5)  (1 unrouted)
  Top 0.254: U10.45 11.75,21.48 v11.41,21.14
  Route2 0.203: v11.41,21.14 11.73,21.46 11.73,24.32 6.33,29.72 U40S.3
  other vias: 1.41,29.72
SHT_DAT  (via drill 0.15 pad 0.5)  (1 unrouted)
  Top 0.203: 12.75,23.93 v12.68,24
  Top 0.254: U10.43 12.75,23.93
  Top 0.457: R40S.2 12.84,24.16 v12.68,24
  Route2 0.203: U40S.2 6.33,30.99 12.68,24.64 v12.68,24
  other vias: 1.41,30.99
SWD_CLK
  Top 0.254: U10.37 19.71,22.69 21.57,20.83 21.57,16.06 21.89,15.75 J10P.2
  Bottom 1.016: J10P.2 Z11P.2
SWD_IO
  Top 0.254: U10.34 19.5,20.04 19.98,19.56 19.98,14.79 21.03,13.75 J10P.1
  Bottom 1.016: Z10P.2 22.62,13.53 J10P.1
VBAT  (via drill 0.15 pad 0.5)
  Top 0.254: U10.26 16.04,16.04 v16.02,16.06
  Top 0.457: R01A.1 v21.41,31.78 R02A.2 C01A.1
  Route2 0.203: v16.02,16.06 19.35,16.06 20.94,17.65 20.94,24 21.41,24.48 v21.41,31.78
VBAT_OV
  Top 0.152: R02O.1 11.07,26.09 11.57,25.59 11.73,25.59 12.21,25.11 R01O.2
  Top 0.203: U01.7 12.5,26.84 12.37,26.7 11.57,26.7 10.94,26.07 R02O.1
VCC  (1 unrouted)
  Top 0.305: 3.95,5.91 U30S.4
  Top 0.457: U30.14 6.67,7 R30S.2
  Top 0.508: U30S.4 5.55,5.91
VDD_3V3  (via drill 0.15 pad 0.5)  (2 unrouted)
  Top 0.254: v15.86,20.83 16.07,21.04 U10.36 18.69,21.04 C11D.1 | U10.48 10.21,22.73 v9.67,22.73 | U01.14 15.97,29.74 C01O.1 | U10.24 15.75,14.32 | 15.75,14.32 15.75,15.16 v15.86,15.27 | C10D.1 15.77,14.34 15.75,14.32
  Top 0.457: R12L.1 v5.06,10.35 | R13L.1 v5.22,20.51 | C12D.1 v9.67,22.73 | R40S.1 v15.06,24.16 | L01O.2 16.18,32.84 16.18,31.62 v16.02,31.46 v16.02,30.83 v16.02,30.19 15.99,30.17 C01O.1
  Top 0.508: U30S.5 U30S.6 5.54,7.81 v5.7,7.65 | L10A.1 5.86,17.81 v6.17,18.13
  Bottom 0.457: R40P.1 3.02,24.22 v3.32,23.92 3.41,23.83 T40P.2
  pour Route2 (rank 2): 25.87,3.75 0,3.75 0,51.5 4.5,51.5 4.5,48.5 11,48.5 11,51.5 25.87,51.5
VDDA
  Top 0.203: 6.85,17.04 6.83,17.02
  Top 0.254: U10.9 6.85,17.04
  Top 0.457: L10A.2 6.83,17.02 C14D.1
VGND  (via drill 0.15 pad 0.5)
  Top 0.254: U10.32 18.76,19.04 v19.03,18.76
  Top 0.457: R02A.1 20.78,33.39 | R02S.1 20.78,33.39 | 20.78,33.39 v20.78,33.37
  Route2 0.203: v19.03,18.76 19.03,28.77 18.08,29.72 18.08,32.26 19.19,33.37 v20.78,33.37
VOUT_SET  (via drill 0.15 pad 0.5)
  Top 0.254: U01.12 15.83,28.74 v15.86,28.77
  Top 0.457: R01V.2 R02V.1 v15.6,25.09 v15.6,25.08
  Bottom 0.254: v15.86,28.77 15.86,25.34 v15.6,25.08
VSTOR  (via drill 0.15 pad 0.5)
  Top 0.203: v13,33.05 12.84,33.05 12.5,32.71 U01.19
  Top 0.254: U01.3 v10.35,29.24
  Top 0.305: U01.6 11.38,27.47 v11.1,27.18
  Top 0.457: C01M.1 9.85,29.24 | 9.85,29.24 C01B.1 | v10.35,29.24 9.85,29.24
  Route15 0.203: v11.1,27.18 10.35,27.92 v10.35,29.24 10.35,31.04 12.37,33.05 v13,33.05
VSUN  (via drill 0.15 pad 0.5)
  Top 0.203: U01.2 10.67,29.74 10.46,29.96 10.46,30.54 C01I.1
  Top 0.457: 9.8,32.87 L01I.1 9.85,32.82 C01I.1 | R01S.2 19.37,30.17 v19.19,30.35
  Top 0.508: S01.1 v1.25,38.61 1.25,35.75 1.41,35.59
  Top 0.762: L01I.1 v9.78,34.8 9.78,34.84 9.19,35.43 1.57,35.43 1.41,35.59
  Route15 0.457: v19.19,30.35 14.75,34.8 v9.78,34.8
  Bottom 0.457: v1.25,39.24 v1.25,38.61 v1.25,37.97
  Bottom 0.508: v1.25,38.61 9.19,38.61 11.04,40.46 SJ02.1
VSYS  (via drill 0.15 pad 0.5)
  Top 0.254: U10.27 16.5,16.54 16.18,16.86 v15.38,16.86
  Top 0.457: R01S.1 v20.14,31.78 R02S.2 C01S.1
  Route2 0.203: v15.38,16.86 18.87,16.86 20.14,18.13 v20.14,31.78
VX
  Top 0.254: U01.8 13,26.09
  Top 0.457: R01O.1 13,26.09 R01V.1
VY  (via drill 0.15 pad 0.5)
  Top 0.457: U40T.4 3.72,22.73 | 3.72,22.73 3.72,22.17 v3.79,22.1 | C41D.1 3.75,22.71 3.72,22.73 | C40D.1 0.94,28.45 U40S.4
  Route15 0.457: U40S.4 0.94,27.97 0.94,24.16 3,22.1 v3.79,22.1
  Bottom 0.457: v3.79,22.1 2.84,22.1 2.52,21.78 T40P.3
  Bottom 0.508: 2.69,21.46 T40P.3
  other vias: 1.41,28.45

### Text on the board
Top: 1
Route2: 2
Route15: 3
Bottom: 4
tPlace: DEBUG | SERIAL | BLE-JIG | 200107-v1.0
bPlace: SERIES: